# EAGLE design snap_breakout_rev_0.92 (EAGLE 5.10)
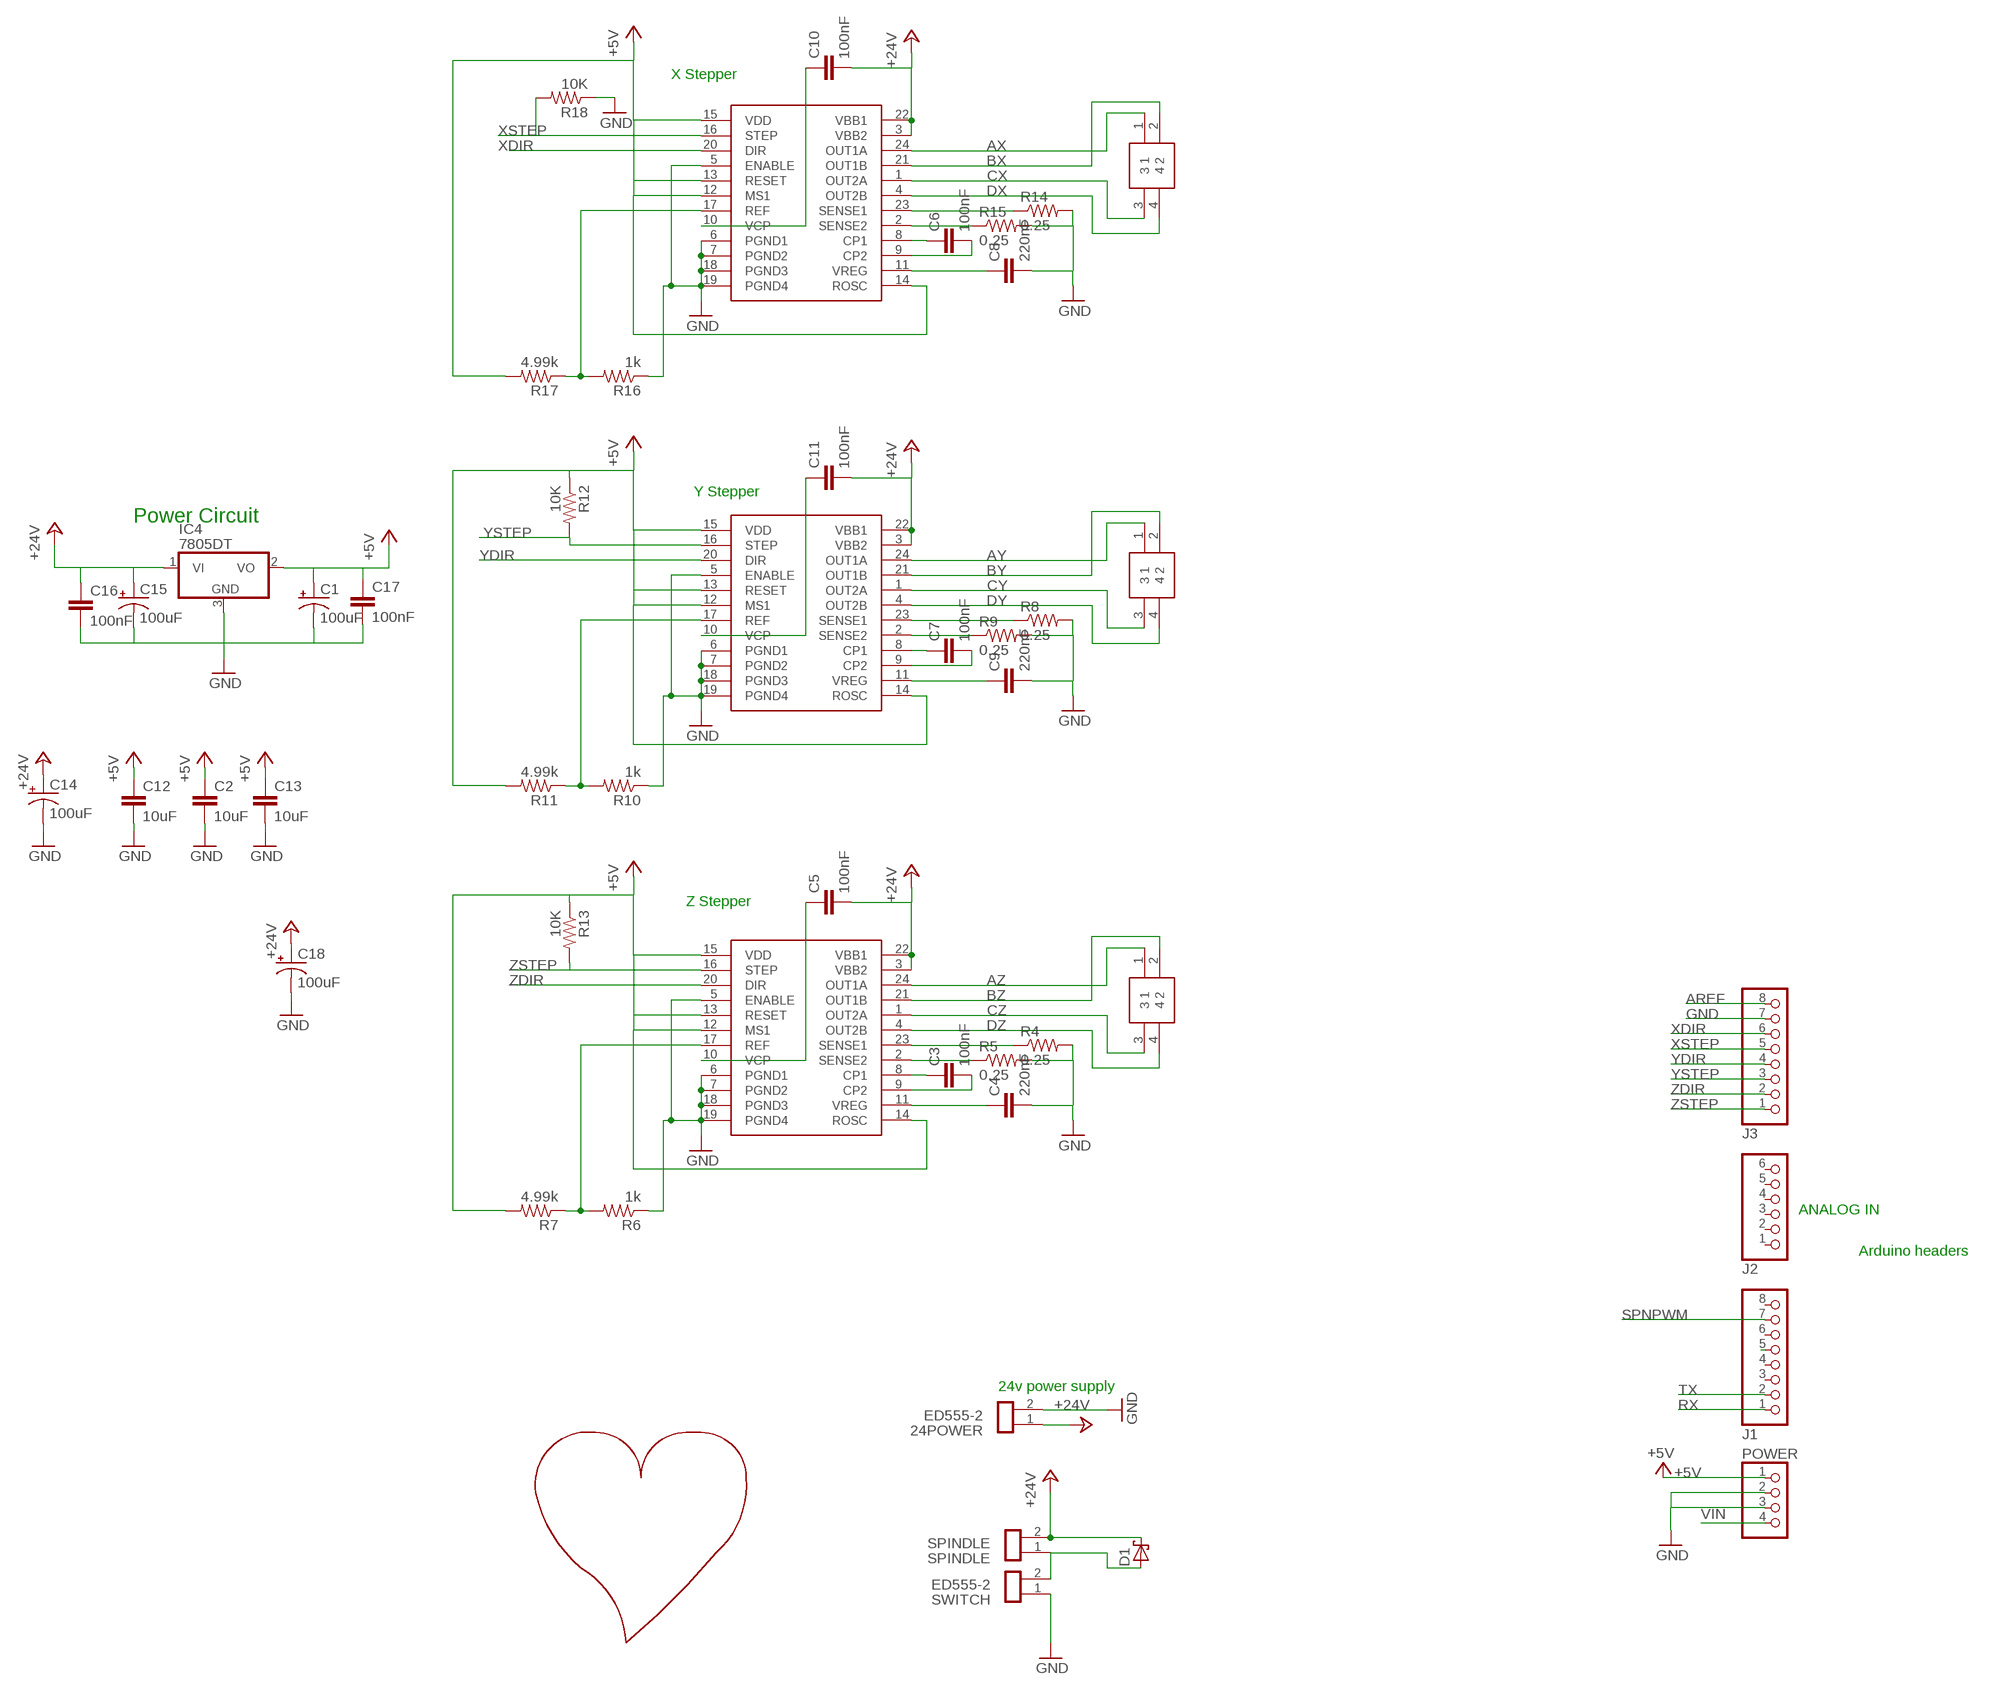
[diagram p0: schematic, sheet 1]

## Parts
24POWER  ED555-2  [ED555-2]
C1  100uF  CPOL-USUD-10X10  [UD-10X10_NICHICON]
C2  10uF  C-EUC1206K  [C1206K]
C3  100nF  C-EUC1206  [C1206]
C4  220nF  C-EUC1206  [C1206]
C5  100nF  C-EUC1206  [C1206]
C6  100nF  C-EUC1206  [C1206]
C7  100nF  C-EUC1206  [C1206]
C8  220nF  C-EUC1206  [C1206]
C9  220nF  C-EUC1206  [C1206]
C10  100nF  C-EUC1206  [C1206]
C11  100nF  C-EUC1206  [C1206]
C12  10uF  C-EUC1206K  [C1206K]
C13  10uF  C-EUC1206K  [C1206K]
C14  100uF  CPOL-USUD-10X10  [UD-10X10_NICHICON]
C15  100uF  CPOL-USUD-10X10  [UD-10X10_NICHICON]
C16  100nF  C-EUC1206K  [C1206K]
C17  100nF  C-EUC1206K  [C1206K]
C18  100uF  CPOL-USUD-10X10  [UD-10X10_NICHICON]
D1  SCHOTTKY-DIODESMC  [SMC]
DRIVER1  A3982  A3982SOIC24  [SO24W]
DRIVER2  A3982  A3982SOIC24  [SO24W]
DRIVER3  A3982  A3982SOIC24  [SO24W]
IC4  7805DT  [TO252]
J1  PINHD-1X8  [1X08]
J2  PINHD-1X6  [1X06]
J3  PINHD-1X8  [1X08]
POWER  PINHD-1X4  [1X04]
R4  0.25  R-US_R2512  [R2512]
R5  0.25  R-US_R2512  [R2512]
R6  1k  RESISTOR1206  [1206]
R7  4.99k  RESISTOR1206  [1206]
R8  0.25  R-US_R2512  [R2512]
R9  0.25  R-US_R2512  [R2512]
R10  1k  RESISTOR1206  [1206]
R11  4.99k  RESISTOR1206  [1206]
R12  10K  R-US_R1206  [R1206]
R13  10K  R-US_R1206  [R1206]
R14  0.25  R-US_R2512  [R2512]
R15  0.25  R-US_R2512  [R2512]
R16  1k  RESISTOR1206  [1206]
R17  4.99k  RESISTOR1206  [1206]
R18  10K  R-US_R1206  [R1206]
SPINDLE  SPINDLE  ED555-2  [ED555-2]
SWITCH  ED555-2  [ED555-2]
U$1  HEART  [HEART]
XSTEP  4-HEADER  [4PIN-HEADER]
YSTEP  4-HEADER  [4PIN-HEADER]
ZSTEP  4-HEADER  [4PIN-HEADER]

## Nets
+5V [power]: C1.+ C2.1 C12.1 C13.1 C17.1 DRIVER1.12(MS1) DRIVER1.13(RESET) DRIVER1.14(ROSC) DRIVER1.15(VDD) DRIVER2.12(MS1) DRIVER2.13(RESET) DRIVER2.14(ROSC) DRIVER2.15(VDD) DRIVER3.12(MS1) DRIVER3.13(RESET) DRIVER3.14(ROSC) DRIVER3.15(VDD) IC4.2(VO) POWER.1 R7.2 R11.2 R12.1 R13.1 R17.2
+24V: 24POWER.1 C5.2 C10.2 C11.2 C14.+ C15.+ C16.1 C18.+ D1.C DRIVER1.3(VBB2) DRIVER1.22(VBB1) DRIVER2.3(VBB2) DRIVER2.22(VBB1) DRIVER3.3(VBB2) DRIVER3.22(VBB1) IC4.1(VI) SPINDLE.2
AREF [power]: J3.8
AX [power]: DRIVER3.24(OUT1A) XSTEP.1
AY [power]: DRIVER1.24(OUT1A) YSTEP.1
AZ [power]: DRIVER2.24(OUT1A) ZSTEP.1
BX [power]: DRIVER3.21(OUT1B) XSTEP.2
BY [power]: DRIVER1.21(OUT1B) YSTEP.2
BZ [power]: DRIVER2.21(OUT1B) ZSTEP.2
CX [power]: DRIVER3.1(OUT2A) XSTEP.3
CY [power]: DRIVER1.1(OUT2A) YSTEP.3
CZ [power]: DRIVER2.1(OUT2A) ZSTEP.3
DX [power]: DRIVER3.4(OUT2B) XSTEP.4
DY [power]: DRIVER1.4(OUT2B) YSTEP.4
DZ [power]: DRIVER2.4(OUT2B) ZSTEP.4
GND [power]: 24POWER.2 C1.- C2.2 C4.2 C8.2 C9.2 C12.2 C13.2 C14.- C15.- C16.2 C17.2 C18.- DRIVER1.5(ENABLE) DRIVER1.6(PGND1) DRIVER1.7(PGND2) DRIVER1.18(PGND3) DRIVER1.19(PGND4) DRIVER2.5(ENABLE) DRIVER2.6(PGND1) DRIVER2.7(PGND2) DRIVER2.18(PGND3) DRIVER2.19(PGND4) DRIVER3.5(ENABLE) DRIVER3.6(PGND1) DRIVER3.7(PGND2) DRIVER3.18(PGND3) DRIVER3.19(PGND4) IC4.3(GND) J3.7 POWER.2 POWER.3 R4.2 R5.2 R6.1 R8.2 R9.2 R10.1 R14.2 R15.2 R16.1 R18.1 SWITCH.1
N$1: D1.A SPINDLE.1 SWITCH.2
N$11 [power]: DRIVER2.23(SENSE1) R4.1
N$12 [power]: DRIVER2.2(SENSE2) R5.1
N$13: C3.1 DRIVER2.8(CP1)
N$14: C3.2 DRIVER2.9(CP2)
N$15: C4.1 DRIVER2.11(VREG)
N$16: C5.1 DRIVER2.10(VCP)
N$21: J1.5
N$22: DRIVER2.17(REF) R6.2 R7.1
N$23 [power]: DRIVER3.23(SENSE1) R14.1
N$24 [power]: DRIVER3.2(SENSE2) R15.1
N$25: C6.1 DRIVER3.8(CP1)
N$26: C6.2 DRIVER3.9(CP2)
N$27: C8.1 DRIVER3.11(VREG)
N$28: C10.1 DRIVER3.10(VCP)
N$29: DRIVER3.17(REF) R16.2 R17.1
N$32 [power]: DRIVER1.23(SENSE1) R8.1
N$33 [power]: DRIVER1.2(SENSE2) R9.1
N$34: C7.1 DRIVER1.8(CP1)
N$35: C7.2 DRIVER1.9(CP2)
N$36: C9.1 DRIVER1.11(VREG)
N$37: C11.1 DRIVER1.10(VCP)
N$41: DRIVER1.17(REF) R10.2 R11.1
RX: J1.1
SPNPWM: J1.7
TX: J1.2
VIN [power]: POWER.4
XDIR: DRIVER3.20(DIR) J3.6
XSTEP: DRIVER3.16(STEP) J3.5 R18.2
YDIR: DRIVER1.20(DIR) J3.4
YSTEP: DRIVER1.16(STEP) J3.3 R12.2
ZDIR: DRIVER2.20(DIR) J3.2
ZSTEP: DRIVER2.16(STEP) J3.1 R13.2
Unconnected: J1.3 J1.4 J1.6 J1.8 J2.1 J2.2 J2.3 J2.4 J2.5 J2.6

## Notes on the sheet
- X Stepper
- Y Stepper
- Power Circuit
- Z Stepper
- ANALOG IN
- Arduino headers
- 24v power supply

## Library data of the parts
24POWER SPINDLE SWITCH = ADS:ED555-2
C1 C14 C15 C18 = rcl:CPOL-US: POLARIZED CAPACITOR, American symbol
C2-C13 C16 C17 = rcl:C-EU: CAPACITOR, European symbol
D1 = diode:SCHOTTKY-DIODE: Schottky Diode
DRIVER1-DRIVER3 = reprap:A3982
IC4 = linear:78*: Positive VOLTAGE REGULATOR Source: http://cache.national.com/ds/LM/LM78L05.pdf http://www.fairchildsemi.com/ds/LM/LM7805.pdf
J1 J3 = pinhead:PINHD-1X8: PIN HEADER
J2 = pinhead:PINHD-1X6: PIN HEADER
POWER = pinhead:PINHD-1X4: PIN HEADER
R4 R5 R8 R9 R14 R15 = rcl:R-US_: RESISTOR, American symbol
R6 R7 R10 R11 R16 R17 = ng:RESISTOR
R12 R13 R18 = resistor:R-US_: RESISTOR, American symbol
U$1 = heart:HEART
XSTEP YSTEP ZSTEP = header_new:4-HEADER

## Net classes
0 default: width 0.203 mm, clearance 0.203 mm
1 power: width 0.305 mm, clearance 0.203 mm

## Board
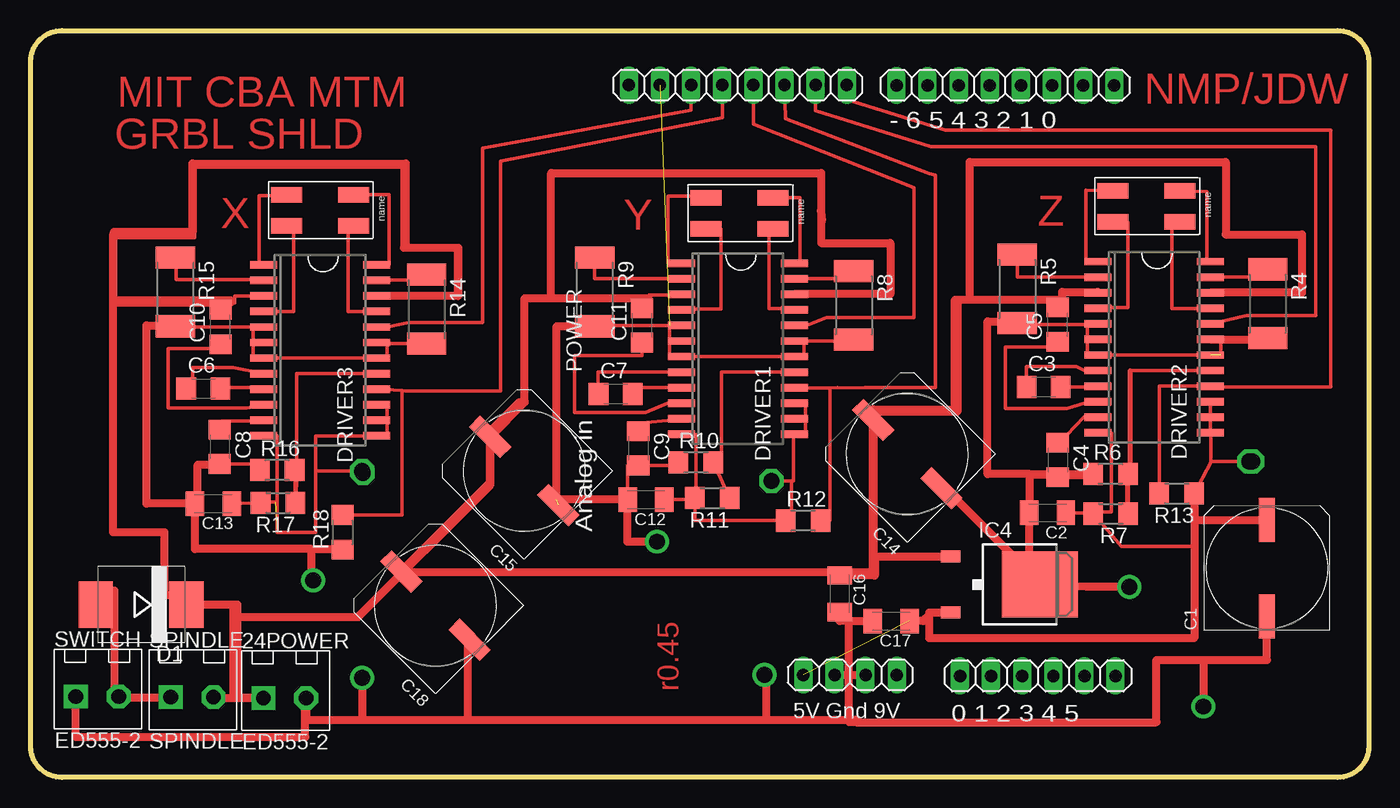
[diagram p1: board, top side]
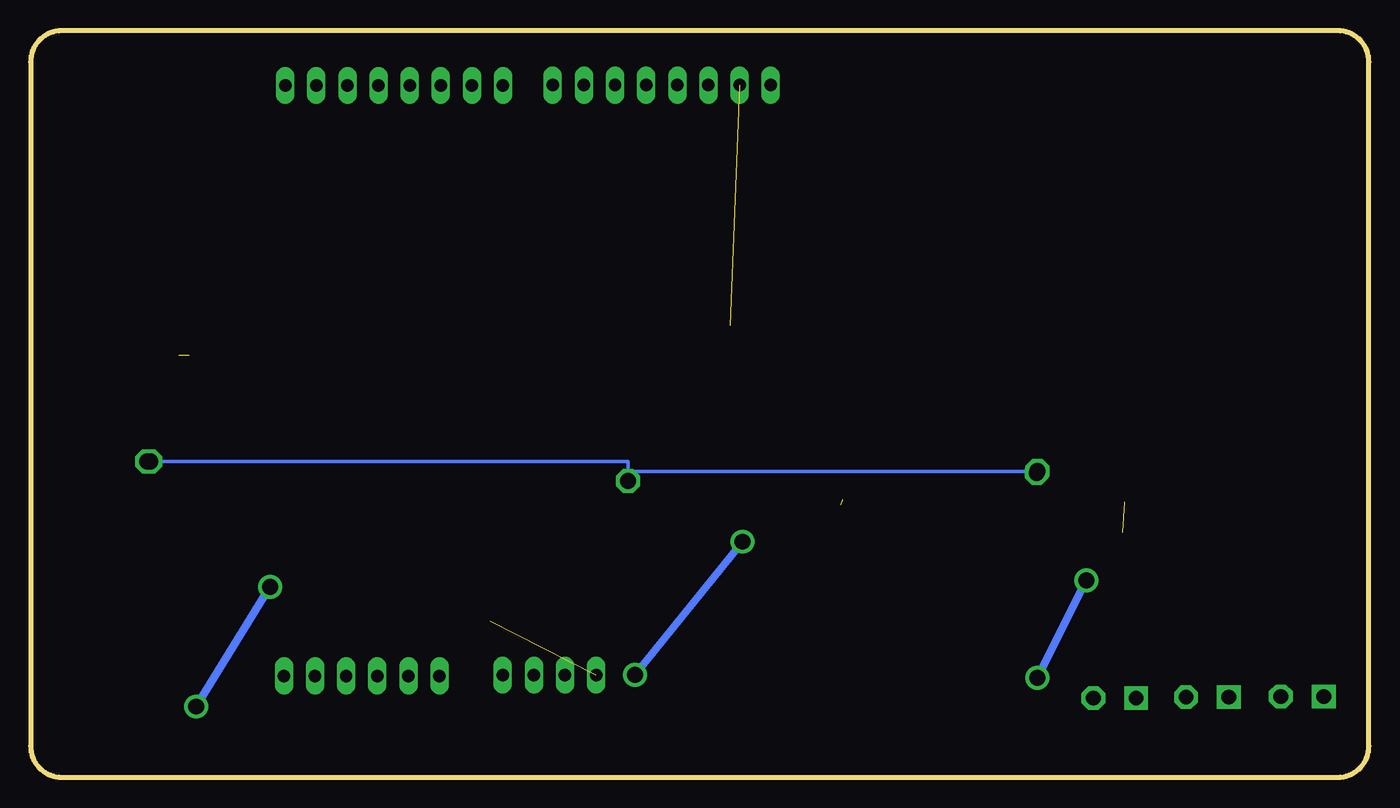
[diagram p2: board, bottom side, seen from below]

Size 109.22 x 60.96 mm. Coordinates in mm from the lower left corner, seen from the top.
Outline: 2.54,60.96 106.68,60.96 arc-90 109.22,58.42 109.22,2.54 arc-90 106.68,0 2.54,0 arc-90 0,2.54 0,58.42 arc-90 2.54,60.96
Copper layers (1*16): Top 0.035mm / dielectric 1.5mm / Bottom 0.035mm
Design rules "default": minimum track width 8mil, minimum drill 16mil, track to track 8mil, track to pad 8mil, pad to pad 8mil, via to via 12mil, smd to smd 8mil, copper to edge 30mil, drill to drill 10mil, minimum pad ring 10mil, minimum via ring 12mil, stop-mask expansion 4mil, vias tented up to drill 0mil, thermal gap 10mil

### Footprints (pad centres in the part's own frame; a part is rotated, then mirrored left to right if it is on the bottom)
ED555-2 = drill 1.194 pad 1.93 square: 1 1.27,1.27 | drill 1.194 pad 1.93 octagon: 2 4.77,1.27
UD-10X10_NICHICON = smd 3.6 x 1.3: + 3.925,0; - -3.95,0
C1206K = smd 1.5 x 2: 1 -1.5,0; 2 1.5,0
C1206 = smd 1.6 x 1.8: 1 -1.4,0; 2 1.4,0
SMC = smd 2.8 x 3.8: A 3.7,0; C -3.7,0
SO24W = smd 0.6 x 2.2: 1 -6.985,-4.6; 2 -5.715,-4.6; 3 -4.445,-4.6; 4 -3.175,-4.6; 5 -1.905,-4.6; 6 -0.635,-4.6; 7 0.635,-4.6; 8 1.905,-4.6; 9 3.175,-4.6; 10 4.445,-4.6; 11 5.715,-4.6; 12 6.985,-4.6; 13 6.985,4.6; 14 5.715,4.6; 15 4.445,4.6; 16 3.175,4.6; 17 1.905,4.6; 18 0.635,4.6; 19 -0.635,4.6; 20 -1.905,4.6; 21 -3.175,4.6; 22 -4.445,4.6; 23 -5.715,4.6; 24 -6.985,4.6
TO252 = smd 1 x 1.6: 1 -2.28,-4.8; 2 2.28,-4.8 | smd 5.4 x 6.2: 3 0,2.5
1X08 = drill 1.016 long: 1 -8.89,0; 2 -6.35,0; 3 -3.81,0; 4 -1.27,0; 5 1.27,0; 6 3.81,0; 7 6.35,0; 8 8.89,0
1X06 = drill 1.016 long: 1 -6.35,0; 2 -3.81,0; 3 -1.27,0; 4 1.27,0; 5 3.81,0; 6 6.35,0
1X04 = drill 1.016 long: 1 -3.81,0; 2 -1.27,0; 3 1.27,0; 4 3.81,0
R2512 = smd 1.8 x 3.2: 1 -2.8,0; 2 2.8,0
1206 = smd 1.6 x 1.803: 1 -1.422,0; 2 1.422,0
R1206 = smd 1.6 x 1.803: 1 -1.422,0; 2 1.422,0
4PIN-HEADER = smd 1.27 x 2.54: 1 -1.27,2.73; 2 1.27,2.73; 3 -1.27,-2.73; 4 1.27,-2.73

### Placement (x,y rotation side)
24POWER  17.72,5.21 0 top
C1  100.9,17.08 90 top
C2  82.99,21.59 180 top
C3  82.68,31.88 0 top
C4  83.82,25.91 270 top
C5  83.82,36.96 90 top
C6  14.1,31.75 0 top
C7  47.75,31.31 0 top
C8  15.43,26.99 270 top
C9  49.59,26.86 270 top
C10  15.49,36.77 90 top
C11  49.91,36.89 90 top
C12  50.23,22.67 180 top
C13  14.92,22.35 180 top
C14  71.54,26.4 135 top
C15  40.28,25.02 135 top
C16  66.04,14.99 270 top
C17  70.23,12.76 180 top
C18  33.03,14.03 135 top
D1  9.02,14.1 180 top
DRIVER1  57.72,34.99 270 top
DRIVER2  91.69,35.12 270 top
DRIVER3  23.62,34.86 270 top
IC4  79.88,15.75 270 top
J1  79.55,56.49 180 top
J2  82.2,8.28 0 top
J3  57.71,56.51 180 top
POWER  66.88,8.36 0 top
R4  100.97,38.67 270 top
R5  80.52,39.88 270 top
R6  88.14,24.77 0 top
R7  88.14,21.53 180 top
R8  67.18,38.54 270 top
R9  46.04,39.62 270 top
R10  54.29,25.72 0 top
R11  55.63,22.8 180 top
R12  63.06,20.95 0 top
R13  93.54,23.18 180 top
R14  32.32,38.23 270 top
R15  11.81,39.62 270 top
R16  20.13,25.08 0 top
R17  20.19,22.42 180 top
R18  25.46,20 90 top
SPINDLE  10.16,5.27 0 top
SWITCH  2.41,5.33 0 top
U$1  47.12,10.35 0 top
XSTEP  23.62,46.29 270 top
YSTEP  57.85,46.04 270 top
ZSTEP  91.06,46.61 270 top

### Tracks (layer width: path | path; a pad name or v marks a point on that pad's centre or on a via)
+5V  (via drill 1.3)  (2 unrouted)
  Top 0.305: R11.2 54.29,23.75 54.29,28 DRIVER1.12 | DRIVER2.15 DRIVER2.14 DRIVER2.13 96.33,28.13 96.33,25.78 | 86.91,28.13 DRIVER2.12 88.2,28.13 88.2,21.65 86.72,21.65 R7.2 | DRIVER3.12 20.13,27.88 20.13,20 23.24,20 23.24,25.02 | 19.94,22.48 18.77,22.48 R17.2 C13.1 | R7.2 86.8,21.53 | R7.2 89,18.86 95,18.86 95,20.7 95,23.18 R13.1 96.33,25.72 96.33,25.78 | C2.1 86.72,21.59 R7.2 | 27.05,25.02 27.24,25.02 27.24,24.83 v27.11,24.83 | v99.7,25.78 96.33,25.78 | R12.1 54.2,20.95 R11.2 | R12.1 62.19,21.34 | 23.24,25.02 23.24,27.88 DRIVER3.13 28.22,27.94 29.08,27.94 29.08,29.15 | 23.24,25.02 27.05,25.02 | 27.05,25.02 v27.05,24.96 | v60.45,24.19 62.1,24.19 | C12.1 54.2,22.67 R11.2 | DRIVER1.15 63.25,30.54 63.25,29.21 62.32,29.21 DRIVER1.14 63.25,29.27 63.25,27.94 62.32,27.94 DRIVER1.13 62.26,28 62.26,24.19 62.1,24.19 | 62.1,24.19 62.1,20.64 61.63,20.64 R12.1 | DRIVER3.15 29.08,30.42 29.08,29.15 | DRIVER3.14 29.08,29.15
  Top 0.635: IC4.2 73.34,13.47 73.34,13.27 | 73.34,13.27 73.34,11.37 94.96,11.37 R13.1 | C17.1 72.83,12.76 73.34,13.27 | C1.+ 95,21.01 95,20.7
  Bottom 0.305: v27.05,24.96 60.45,24.96 v60.45,24.19 60.45,25.78 v99.7,25.78
+24V
  Top 0.305: 15.43,38.1 15.49,38.1 C10.2 15.49,38.73 | 28.26,39.31 DRIVER3.22 | 34.86,39.31 34.86,43.12 30.42,43.12 30.42,50.04 13.4,50.04 13.4,44.07 6.73,44.07 | 6.73,39.12 15.49,39.12 15.49,38.73 | DRIVER3.3 16.64,39.31 16.64,38.73 16.32,38.73 15.49,38.73 | C11.2 50.42,38.29 50.48,38.29 50.48,39.37 53.12,39.37 DRIVER1.3
  Top 0.635: 30.61,43.24 30.61,50.1 13.21,50.1 13.21,44.26 6.73,44.26 6.73,44.07 6.73,39.12 6.73,20 10.92,20 10.92,14.86 11.43,14.86 11.43,14.92 11.88,14.92 11.88,14.1 D1.C | 30.61,43.24 34.86,43.24 | 34.86,43.24 34.92,43.24 34.92,39.31 34.86,39.31 | 34.86,39.31 28.26,39.31 | DRIVER1.22 70.17,39.43 70.17,43.62 64.52,43.62 64.48,46.23 | 64.48,46.23 64.52,49.34 42.48,49.34 42.48,39.12 | 42.48,39.12 50.42,39.12 50.42,38.29 | 42.48,39.12 40.32,39.12 40.32,30.67 | DRIVER2.22 103.76,39.56 103.76,44.32 97.54,44.32 97.54,50.23 76.65,50.23 76.65,38.99 | 64.48,46.23 64.58,45.4 | SPINDLE.2 14.93,6.48 16.89,6.48 | 40.32,30.65 C15.+ | 40.32,30.67 40.32,30.65 | D1.C 12.57,14.1 | 76.65,38.99 83.88,38.99 | 83.88,38.99 C5.2 | 83.88,38.99 84.2,38.99 84.2,39.62 87.09,39.62 DRIVER2.3 | 75.63,38.99 76.65,38.99 | 75.63,38.99 75.63,29.91 | 75.63,29.91 68.77,29.91 C14.+ 68.77,18.03 68.9,18.03 | 68.9,18.03 IC4.1 | C16.1 68.9,16.49 68.9,18.03 | 75.63,29.91 75.63,29.84 68.71,29.84 68.71,16.51 65.41,16.51 65.41,16.13 | 34.86,43.24 34.86,39.31 | 30.61,43.24 30.48,43.24 30.48,50.04 13.4,50.04 13.21,50.04 13.21,44.51 6.79,44.51 6.79,38.93 16.32,38.93 16.32,38.73 6.86,38.73 | 16.89,6.48 24POWER.1 16.57,6.48 16.57,13.08 | 16.57,14.1 16.89,14.1 16.89,6.48 | 16.57,14.1 D1.C | 16.57,13.08 16.57,14.1 | 40.32,30.65 40.32,30.61 39.88,30.61 37.46,28.19 37.46,24.01 C18.+ 30.26,16.76 68.77,16.76 68.77,30.04 75.44,30.04 75.44,38.99 75.63,38.99 | 40.32,30.67 37.53,27.88 37.53,23.88 26.73,13.08 16.57,13.08
AX
  Top 0.305: DRIVER3.24 29.27,41.85 29.27,47.56 XSTEP.1
AY
  Top 0.305: DRIVER1.24 62.8,41.97 62.8,47.31 YSTEP.1
AZ
  Top 0.305: ZSTEP.1 96.01,47.82 96.01,42.1 DRIVER2.24
BX
  Top 0.305: DRIVER3.21 25.91,38.04 25.91,45.02 XSTEP.2
BY
  Top 0.305: DRIVER1.21 62.32,38.29 60.26,38.29 60.26,44.77 YSTEP.2
BZ
  Top 0.305: DRIVER2.21 93.16,38.29 93.16,45.34 ZSTEP.2
CX
  Top 0.305: XSTEP.3 20.89,47.5 18.67,47.5 18.67,41.85 DRIVER3.1
CY
  Top 0.305: YSTEP.3 55.12,47.44 52.01,47.44 52.01,41.97 DRIVER1.1
CZ
  Top 0.305: ZSTEP.3 86.11,47.94 86.11,42.1 DRIVER2.1
DX
  Top 0.305: DRIVER3.4 21.46,38.04 21.46,45.02 XSTEP.4
DY
  Top 0.305: DRIVER1.4 53.12,38.23 56.32,38.23 56.32,44.77 YSTEP.4
DZ
  Top 0.305: DRIVER2.4 87.09,38.35 89.54,38.35 89.54,45.34 ZSTEP.4
GND  (via drill 1.3)  (3 unrouted)
  Top 0.305: POWER.2 65.6,8.36 | DRIVER2.18 DRIVER2.7 87.09,34.54 86.23,34.54 86.23,35.75 DRIVER2.6 87.09,35.69 86.23,35.69 86.23,37.02 DRIVER2.5 87.09,36.96 80.77,36.96 80.77,37.08 R5.2 | R9.2 46.04,36.89 DRIVER1.5 52.13,36.89 52.13,35.62 | R15.2 11.94,36.77 DRIVER3.5 18.16,36.77 18.16,35.5 | R10.1 52.87,25.46 C9.2 48.73,25.46 C12.2 | C8.2 18.77,25.59 R16.1 | R8.2 67.18,35.62 DRIVER1.19 63.12,35.62 63.12,34.35 DRIVER1.18 DRIVER1.7 52.13,34.35 52.13,35.62 | C2.2 81.6,21.59 | C4.2 81.49,24.51 | 52.13,35.62 DRIVER1.6 | R14.2 28.22,35.43 DRIVER3.19 29.08,35.5 29.08,34.23 DRIVER3.18 DRIVER3.7 18.16,34.23 18.16,35.5 | 18.16,35.5 DRIVER3.6 | DRIVER2.19 97.16,35.75 97.16,34.48
  Top 0.406: C4.2 86.72,24.51 R6.1
  Top 0.635: R4.2 100.68,35.74 DRIVER2.19 | 81.79,16.45 82.49,15.75 IC4.3 86.17,15.56 v89.66,15.56 | 81.79,16.45 81.6,16.64 81.49,16.64 C2.2 81.53,21.59 81.53,24.77 | 81.53,24.77 78.11,24.77 78.11,37.21 80.52,37.21 R5.2 | 81.53,24.77 R6.1 | C14.- 74.64,23.61 81.79,16.45 | C1.- 100.9,9.59 95.69,9.59 | 95.69,9.59 91.88,9.59 91.88,4.51 67.37,4.51 | 67.37,4.51 66.8,4.51 66.8,8.32 | 66.8,8.32 65.61,8.32 POWER.2 POWER.3 | 66.8,12.76 C17.2 | C16.2 66.04,12.76 66.8,12.76 | 66.8,8.32 66.8,12.76 | 24POWER.2 22.61,6.48 | 3.56,6.6 SWITCH.1 3.68,3.3 22.41,3.3 22.41,6.48 | C13.2 9.46,22.35 9.46,36.89 11.81,36.89 R15.2 | C13.2 13.65,22.35 13.65,25.53 15.43,25.53 C8.2 | 22.92,18.64 13.42,18.64 C13.2 | 22.92,18.64 25.4,18.64 R18.1 | R9.2 42.93,36.83 42.93,22.67 C12.2 48.7,22.41 48.7,19.24 v51.12,19.24 | 95.69,9.59 v95.69,5.78 | 22.48,6.73 22.41,6.73 22.41,6.48 | 22.41,6.48 24POWER.2 | 24POWER.2 22.48,4.7 27.11,4.7 | 27.11,4.7 35.69,4.7 | 35.69,4.7 60.07,4.7 | 60.07,4.7 67.37,4.7 67.37,4.51 | v59.88,8.38 60.07,8.38 60.07,4.7 | C18.- 35.69,11.24 35.69,4.7 | v27.05,8.13 27.11,8.13 27.11,4.7 | v23.05,16.07 22.92,16.07 22.92,18.64
  Bottom 0.635: v27.05,8.13 v23.05,16.07 | v59.88,8.38 v51.12,19.24 | v95.69,5.78 v89.66,15.56
N$1
  Top 0.635: D1.A 5.57,15.24 6.86,15.24 6.86,6.6 SWITCH.2 7.18,6.54 SPINDLE.1
N$2  (via drill 1.3)
  other vias: 27.05,25.02
N$3  (via drill 1.3)
  other vias: 60.45,24.19
N$4  (via drill 1.3)
  other vias: 99.44,25.78
N$11
  Top 0.305: R4.1 100.08,40.83 DRIVER2.23
N$12
  Top 0.305: R5.1 80.52,40.83 DRIVER2.2
N$13
  Top 0.305: C3.1 81.28,33.53 85.34,33.53 86.17,33.15 DRIVER2.8
N$14
  Top 0.305: DRIVER2.9 87.09,31.88 C3.2
N$15
  Top 0.305: C4.1 83.82,27.94 84.58,27.94 85.98,29.4 DRIVER2.11
N$16
  Top 0.305: DRIVER2.10 87.09,30.61 87.57,30.61 87.57,30.54 86.04,30.54 84.58,30.1 79.57,30.1 79.57,35.12 83.82,35.12 C5.1
N$22
  Top 0.305: 89.75,33.21 DRIVER2.17
  Top 0.406: 89.56,21.65 R7.1 R6.2 89.75,24.77 89.75,33.21
N$23
  Top 0.305: R14.1 32.13,40.58 DRIVER3.23
N$24
  Top 0.305: DRIVER3.2 19.02,40.64 11.88,40.64 11.88,42.42 R15.1
N$25
  Top 0.305: DRIVER3.8 16.55,33.46 13.21,33.46 13.21,31.56 C6.1
N$26
  Top 0.305: DRIVER3.9 18.2,31.81 15.68,31.81 15.68,31.18 C6.2
N$27
  Top 0.305: DRIVER3.11 19.02,29.08 15.62,29.08 15.62,28.13 C8.1
N$28
  Top 0.305: DRIVER3.10 17.62,30.16 11.24,30.16 11.24,34.99 15.18,34.99 15.49,35.24 C10.1
N$29
  Top 0.305: R16.2 R17.1 21.68,22.22 21.72,25.08 21.72,32.96 DRIVER3.17
N$32
  Top 0.305: R8.1 65.85,40.7 DRIVER1.23
N$33
  Top 0.305: R9.1 46.04,40.7 DRIVER1.2
N$34
  Top 0.305: DRIVER1.8 46.29,33.08 C7.1
N$35
  Top 0.305: C7.2 49.15,31.81 DRIVER1.9
N$36
  Top 0.305: C9.1 49.47,28.89 52.74,29.21 DRIVER1.11
N$37
  Top 0.305: DRIVER1.10 53.25,30.48 52.01,30.54 50.16,29.78 44.39,29.78 44.39,34.42 49.91,34.42 C11.1
N$41
  Top 0.305: DRIVER1.17 56.39,33.08 56.39,26.61 R10.2 R11.1
XDIR
  Top 0.305: DRIVER3.20 29.08,36.77 30.86,37.15 36.89,37.15 36.89,51.37 53.91,54.48 J3.6
XSTEP
  Top 0.305: 30.32,31.57 DRIVER3.16 | 30.32,31.57 30.61,31.56 38.35,31.56 38.35,50.29 56.45,53.85 J3.5 | R18.2 30.32,21.42 30.32,31.57
YDIR
  Top 0.305: J3.4 58.99,53.34 72.07,48.13 72.07,37.53 64.96,37.53 63.31,36.89 DRIVER1.20
YSTEP
  Top 0.305: 64.84,31.78 65.85,31.81 | J3.3 61.59,53.78 73.34,49.28 73.85,49.15 73.85,31.81 68.07,31.81 65.23,31.78 | 65.23,31.78 64.84,31.78 | R12.2 65.23,20.95 65.23,31.78 | 64.84,31.78 62.32,31.78 DRIVER1.16
ZDIR
  Top 0.305: J3.2 64.07,54.42 73.47,51.5 104.9,51.5 104.9,37.72 99.22,37.72 DRIVER2.20
ZSTEP
  Top 0.305: R13.2 92.11,22.8 92.14,22.8 92.14,31.94 DRIVER2.16 96.29,31.88 106.11,31.88 106.11,52.83 74.68,52.83 66.61,55.31 66.61,56.51 J3.1

### Text on the board
Top: MIT CBA MTM | NMP/JDW | GRBL SHLD | X | Y | Z | r0.45
tNames: - 6 5 4 3 2 1 0 | Analog in | 5V Gnd 9V | 0 1 2 3 4 5